# Altium schematic sheet Sheet1.SchDoc
size A4; SheetNumber: 2; SheetTotal: 2
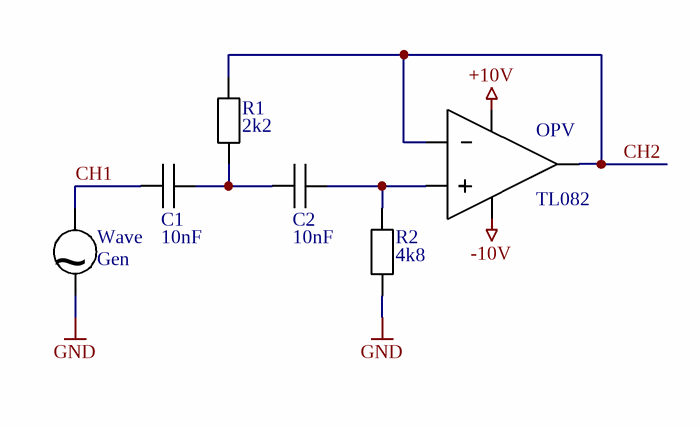
[diagram p0: Sheet1.SchDoc]

## Parts
C1  10nF
C2  10nF
R1  2k2
R2  4k8
TL082  OPV
Wave  Gen

## Nets
+10V: TL082.34
-10V: TL082.33
GND: R2.1 Wave.?1
CH1: C1.1 Wave.?2
CH2: R1.2 TL082.31(-) TL082.35
NetC1_2: C1.2 C2.1 R1.1
NetC2_2: C2.2 R2.2 TL082.32(+)

## Notes on the sheet
- (in symbol Sinus_Gen) ~

## Library data of the parts
C1 C2 = Kondensator
R1 R2 = Widerstand
TL082 = Verstärker
Wave = Sinus_Gen